# Altium schematic sheet Power.SchDoc
size A
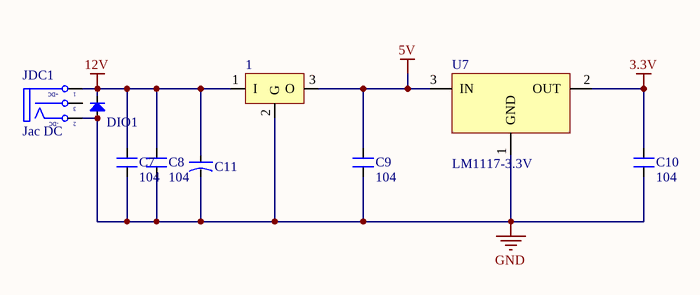
[diagram p0: Power.SchDoc]

## Parts
1  LM78xx  [TO252-123]  (value not drawn)
C7  104  [SM-CAP-0805]
C8  104  [SM-CAP-0805]
C9  104  [SM-CAP-0805]
C10  104  [SM-CAP-0805]
C11  CN-ALU-SMD  [CAP-ALU-SMD-4.5x5x1.4]  (value not drawn)
DIO1  Diode SMD  [DIO-SMD-106]  (value not drawn)
JDC1  Jac DC  [DC3]
U7  LM1117-3.3V  [SOT223]

## Nets
3.3V: C10.2 U7.2(OUT)
5V: 1.3(O) C9.2 U7.3(IN)
12V: 1.1(I) C7.2 C8.2 C11.1 DIO1.2(K) JDC1.1(T)
GND: 1.2(G) C7.1 C8.1 C9.1 C10.1 C11.2 DIO1.1(A) JDC1.2(TN) U7.1(GND)

Not connected (* = marked no-connect by the designer): JDC1 3(S)

## Notes on the sheet
- (in symbol DCIN) +DC; -DC

## Library data of the parts
1 = LM78xx: Positive Voltage Regulator; Note: Tab is connected to pin 3 (GND).; Published: 24-Aug-2001; LatestRevisionDate: 17-Jul-2002; LatestRevisionNote: Re-released for DXP Platform.; DatasheetVersion: Apr-1994; PackageVersion: Jul-1998; PackageReference: ISOWATT220AB; Publisher: Altium Limited; PackageDescription: TO, Thru-Hole, Vertical, Heatsink Mounted; 3 In-Line Leads; Pitch 2.54 mm; Pin sequence 1, 3, 2; ComponentLink1Description: Manufacturer Link; ComponentLink1URL: http://www.st.com/; ComponentLink2Description: Datasheet; ComponentLink2URL: http://www.st.com/stonline/products/literature/ds/2146/l78m05c.pdf
C7-C10 = CN: Value: 0,1uF/300V; Designed by: VanDungEvn
C11 = CN-ALU-SMD: Polarized Capacitor (Axial); Published: 8-Jun-2000; LatestRevisionDate: 17-Jul-2002; LatestRevisionNote: Re-released for DXP Platform.; PackageReference: POLAR0.8; Publisher: Altium Limited
DIO1 = Diode SMD: Default Diode; Code - JEDEC: DO-214-AB; Value: 1N5007; Published: 8-Jun-2000; Revision: July-2002: Re-released for DXP Platform.; Publisher: Altium Limited
JDC1 = DCIN: Jac DC input; Value: Jac DC
U7 = LM1117: 800mA Low-Dropout Linear Regulator; Creator: Nguyen Ba Bien; Website: http://group3i.net